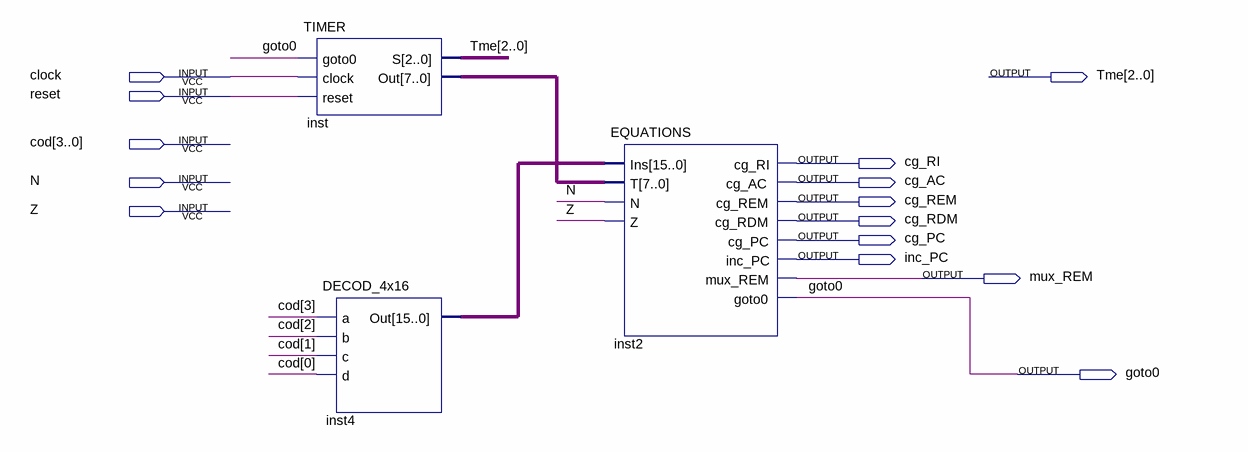
[diagram p0: schematic sheet]
// Quartus schematic CONTROL.bdf as structural Verilog: 3 symbols, 14 pins
module CONTROL (
  input  clock,
  input  reset,
  input  [3:0] cod,
  input  N,
  input  Z,
  output [2:0] Tme,
  output cg_RI,
  output cg_AC,
  output cg_REM,
  output cg_RDM,
  output cg_PC,
  output inc_PC,
  output mux_REM,
  output goto0
);

  wire [7:0] inst_out;
  wire [15:0] inst4_out;

  TIMER inst (.goto0(goto0), .clock(clock), .reset(reset), .S(Tme), .Out(inst_out));
  DECOD_4x16 inst4 (.a(cod[3]), .b(cod[2]), .c(cod[1]), .d(cod[0]), .Out(inst4_out));
  EQUATIONS inst2 (
    .Ins(inst4_out), .T(inst_out), .N(N), .Z(Z), .cg_RI(cg_RI), .cg_AC(cg_AC), .cg_REM(cg_REM),
    .cg_RDM(cg_RDM), .cg_PC(cg_PC), .inc_PC(inc_PC), .mux_REM(mux_REM), .goto0(goto0));
endmodule
